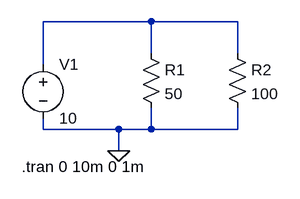
[diagram p0: schematic Shubham Rattra _ UE185112 _ Exp1.asc]
Shubham Rattra _ UE185112 _ Exp1.asc, the LTspice schematic file:
Version 4
SHEET 1 880 680
WIRE 224 32 64 32
WIRE 352 32 224 32
WIRE 224 80 224 32
WIRE 352 80 352 32
WIRE 64 96 64 32
WIRE 64 192 64 176
WIRE 176 192 64 192
WIRE 224 192 224 160
WIRE 224 192 176 192
WIRE 352 192 352 160
WIRE 352 192 224 192
WIRE 176 224 176 192
FLAG 176 224 0
SYMBOL res 208 64 R0
SYMATTR InstName R1
SYMATTR Value 50
SYMBOL res 336 64 R0
SYMATTR InstName R2
SYMATTR Value 100
SYMBOL voltage 64 80 R0
WINDOW 123 0 0 Left 0
WINDOW 39 0 0 Left 0
SYMATTR InstName V1
SYMATTR Value 10
TEXT 32 248 Left 2 !.tran 0 10m 0 1m

The netlist it stands for:
* Shubham Rattra _ UE185112 _ Exp1.asc
R1 N001 0 50
R2 N001 0 100
V1 N001 0 10
.tran 0 10m 0 1m
.backanno
.end